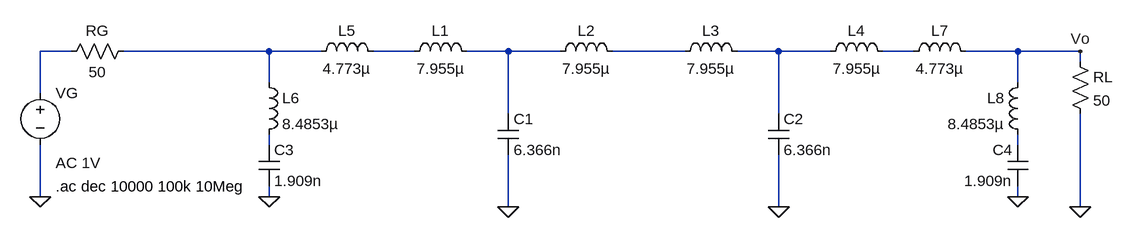
[diagram p0: schematic ej5.asc]
ej5.asc, the LTspice schematic file:
Version 4
SHEET 1 1684 804
WIRE -64 96 -112 96
WIRE 240 96 16 96
WIRE 320 96 240 96
WIRE 464 96 400 96
WIRE 608 96 544 96
WIRE 688 96 608 96
WIRE 880 96 768 96
WIRE 1024 96 960 96
WIRE 1104 96 1024 96
WIRE 1232 96 1184 96
WIRE 1392 96 1312 96
WIRE 1488 96 1392 96
WIRE 1488 112 1488 96
WIRE 240 144 240 96
WIRE 1392 144 1392 96
WIRE -112 160 -112 96
WIRE 608 192 608 96
WIRE 1024 192 1024 96
WIRE 240 240 240 224
WIRE 1392 240 1392 224
WIRE -112 320 -112 240
WIRE 240 320 240 304
WIRE 1392 320 1392 304
WIRE 608 336 608 256
WIRE 1024 336 1024 256
WIRE 1488 336 1488 192
FLAG 608 336 0
FLAG -112 320 0
FLAG 1488 336 0
FLAG 1024 336 0
FLAG 1488 96 Vo
FLAG 240 320 0
FLAG 1392 320 0
SYMBOL ind 448 112 R270
WINDOW 0 32 56 VTop 2
WINDOW 3 5 56 VBottom 2
SYMATTR InstName L1
SYMATTR Value 7.955µ
SYMBOL ind 672 112 R270
WINDOW 0 32 56 VTop 2
WINDOW 3 5 56 VBottom 2
SYMATTR InstName L2
SYMATTR Value 7.955µ
SYMBOL cap 592 192 R0
SYMATTR InstName C1
SYMATTR Value 6.366n
SYMBOL res 32 80 R90
WINDOW 0 0 56 VBottom 2
WINDOW 3 32 56 VTop 2
SYMATTR InstName RG
SYMATTR Value 50
SYMBOL res 1472 96 R0
SYMATTR InstName RL
SYMATTR Value 50
SYMBOL voltage -112 144 R0
WINDOW 123 24 124 Left 2
WINDOW 39 0 0 Left 0
SYMATTR Value2 AC 1V
SYMATTR InstName VG
SYMATTR Value ""
SYMBOL ind 864 112 R270
WINDOW 0 32 56 VTop 2
WINDOW 3 5 56 VBottom 2
SYMATTR InstName L3
SYMATTR Value 7.955µ
SYMBOL ind 1088 112 R270
WINDOW 0 32 56 VTop 2
WINDOW 3 5 56 VBottom 2
SYMATTR InstName L4
SYMATTR Value 7.955µ
SYMBOL cap 1008 192 R0
SYMATTR InstName C2
SYMATTR Value 6.366n
SYMBOL ind 304 112 R270
WINDOW 0 32 56 VTop 2
WINDOW 3 5 56 VBottom 2
SYMATTR InstName L5
SYMATTR Value 4.773µ
SYMBOL ind 224 128 R0
SYMATTR InstName L6
SYMATTR Value 8.4853µ
SYMBOL cap 224 240 R0
SYMATTR InstName C3
SYMATTR Value 1.909n
SYMBOL ind 1328 112 M270
WINDOW 0 32 56 VTop 2
WINDOW 3 5 56 VBottom 2
SYMATTR InstName L7
SYMATTR Value 4.773µ
SYMBOL ind 1408 128 M0
SYMATTR InstName L8
SYMATTR Value 8.4853µ
SYMBOL cap 1408 240 M0
SYMATTR InstName C4
SYMATTR Value 1.909n
TEXT -88 304 Left 2 !.ac dec 10000 100k 10Meg

The netlist it stands for:
* ej5.asc
L1 N003 N004 7.955µ
L2 N004 N005 7.955µ
C1 N004 0 6.366n
RG N002 N001 50
RL Vo 0 50
VG N001 0 AC 1V
L3 N005 N006 7.955µ
L4 N006 N007 7.955µ
C2 N006 0 6.366n
L5 N002 N003 4.773µ
L6 N002 N008 8.4853µ
C3 N008 0 1.909n
L7 Vo N007 4.773µ
L8 Vo N009 8.4853µ
C4 N009 0 1.909n
.ac dec 10000 100k 10Meg
.backanno
.end